# EAGLE design led (EAGLE 9.5.0)
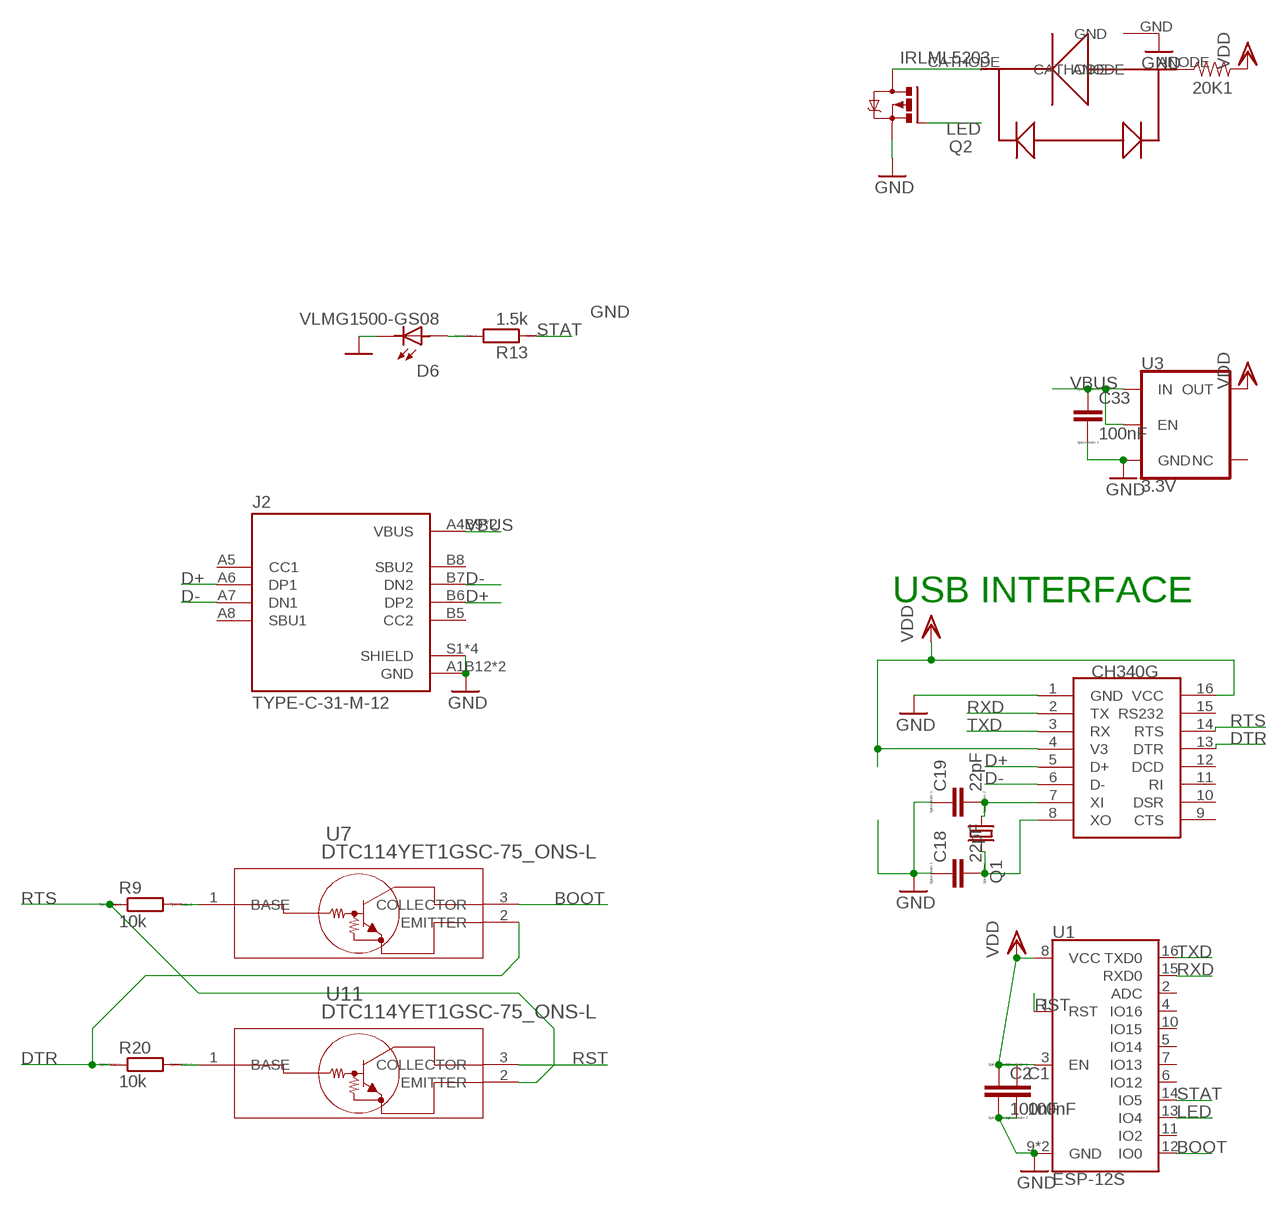
[diagram p0: schematic, sheet 1]

## Parts
20K1  0.05  0.1OHM-1210-1/2W-1%  [1210]
C1  100nF  CC0402  [C0402]
C2  100nF  CC0402  [C0402]
C18  22pF  CC0402  [C0402]
C19  22pF  CC0402  [C0402]
C33  100nF  CC0402  [C0402]
D6  VLMG1500-GS08  [LEDC1005X35N]
J2  TYPE-C-31-M-12  [HRO_TYPE-C-31-M-12]
Q1  KX-7  [3.2X2.5_KX-7]
Q2  IRLML5203  [MICRO3]
R9  10k  RR0402  [R0402]
R13  1.5k  RR0402  [R0402]
R20  10k  RR0402  [R0402]
U1  ESP-12S  [ESP-12S]
U3  3.3V  V_REG_AP2112K-3.3V  [SOT23-5]
U5  H  CH340G  [SOIC16]
U7  DTC114YET1GSC-75_ONS-L  [SC-75_ONS-L]
U11  DTC114YET1GSC-75_ONS-L  [SC-75_ONS-L]
U$1  ELSW(1W)  [ELSW(1W)]

## Nets
BOOT: U1.12(IO0) U7.3(COLLECTOR)
D+: J2.A6(DP1) J2.B6(DP2) U5.5(D+)
D-: J2.A7(DN1) J2.B7(DN2) U5.6(D-)
DTR: R20.1 U5.13(DTR) U7.2(EMITTER)
GND: C1.2 C2.2 C18.1 C19.1 C33.2 D6.2 J2.A1B12(GND) J2.B1A12(GND) J2.S1(SHIELD) J2.S2(SHIELD) J2.S3(SHIELD) J2.S4(SHIELD) Q2.2(S) U1.9(GND) U1.P$1(GND) U3.2(GND) U5.1(GND) U$1.GND
LED: Q2.1(G) U1.13(IO4)
N$1: 20K1.1 U$1.ANODE
N$2: Q2.3(D) U$1.CATHODE
N$5: C18.2 Q1.3 U5.8(XO)
N$9: C19.2 Q1.1 U5.7(XI)
N$27: D6.1 R13.2
N$29: R20.2 U11.1(BASE)
N$30: R9.2 U7.1(BASE)
RST: U1.1(RST) U11.3(COLLECTOR)
RTS: R9.1 U5.14(RTS) U11.2(EMITTER)
RXD: U1.15(RXD0) U5.2(TX)
STAT: R13.1 U1.14(IO5)
TXD: U1.16(TXD0) U5.3(RX)
VBUS: C33.1 J2.A4B9(VBUS) J2.B4A9(VBUS) U3.1(IN) U3.3(EN)
VDD: 20K1.2 C1.1 C2.1 U1.3(EN) U1.8(VCC) U3.5(OUT) U5.4(V3) U5.16(VCC)
Unconnected: J2.A5(CC1) J2.A8(SBU1) J2.B5(CC2) J2.B8(SBU2) U1.2(ADC) U1.4(IO16) U1.5(IO14) U1.6(IO12) U1.7(IO13) U1.10(IO15) U1.11(IO2) U3.4(NC) U5.9(CTS) U5.10(DSR) U5.11(RI) U5.12(DCD) U5.15(RS232)

## Notes on the sheet
- USB INTERFACE

## Library data of the parts
20K1 = SparkFun-Resistors:0.1OHM: 0.1Ω resistor A resistor is a passive two-terminal electrical component that implements electrical resistance as a circuit element. Resistors act to reduce current flow, and, at the same time, act to lower voltage levels within circuits. - Wikipedia; PROD_ID: RES-12374; VALUE: 0.1
C1 C2 C18 C19 C33 = eagle-ltspice:C: CAPACITOR, European symbol; SPICEMODEL: NONE; SPICEPREFIX: C
D6 = VLMG1500-GS08:VLMG1500-GS08: 0402 GREEN 571nm 35MCD 65° Rectangle with Flat Top SMT LED; AVAILABILITY: Unavailable; DESCRIPTION: 0402 GREEN 571nm 35MCD 65° Rectangle with Flat Top SMT LED; MF: Vishay; MP: VLMG1500-GS08; PACKAGE: 0402 Vishay; PRICE: None
J2 = TYPE-C-31-M-12:TYPE-C-31-M-12: USB Connectors 24 Receptacle 1 8.94*7.3mm RoHS Check prices <https://pricing.snapeda.com/parts/TYPE-C-31-M-12/HRO%20Electronics%20Co.%2C%20Ltd./view-part?ref=eda>; AVAILABILITY: Not in stock; DESCRIPTION: USB Connectors 24 Receptacle 1 8.94*7.3mm RoHS; MF: HRO Electronics Co., Ltd.; MP: TYPE-C-31-M-12; PACKAGE: Package; PRICE: None
Q1 = crystal-geyer_V1_0:KX: Quartz Crystals (MHz) SMD: KX - Serie Model Size l/w/h [mm] Frequency Range Frequency Stability Temp. Range [°C] Load Capacitance AECQ 200 availabel Datasheet KX-4 KX-5 KX-6 KX-7 KX-9A KX-9B KX-12A KX-12B KX-13 KX-20 KX-K KX-KS 1.6/1.2/0.3 2.0/1.6/0.45 2.5/2.0/0.55 3.2/2.5/0.8 5.0/3.2/1.0 5.0/3.2/1.1 6.0/3.5/1.1 6.0/3.5/1.0 7.0/5.0 /1.3 11.6/5.5/1.6 12.3/4.5/4.2 12.3/4.5/3.2 24.0 ~ 80.0 MHz 16.0 ~ 80.0 MHz 12.0 ~ 80.0 MHz 8.0 ~ 60.0 MHz 7,68 ~ 300,0 MHz 8,0 ~ 50,0 MHz 8,0 ~ 150,0 MHz 8,0 ~ 50,0 MHz 6,0 ~ 160,0 MHz 3,579 ~ 25,0 MHz 3,579 ~ 70,0 MHz 3,579 ~ 70,0 MHz ±10 … ±50ppm ±10 … ±50ppm ±10 … ±50ppm ±10 … ±50ppm ±10 … ±50ppm ±10 … ±50ppm ±10 … ±50ppm ±10 … ±50ppm ±10 … ±50ppm ±50ppm ±10 … ±50ppm ±10 … ±50ppm (*) -40°C …+85°C (*) -40°C …+125°C (*) -40°C …+125°C (*) -40°C …+125°C (*) -40°C …+105°C (*) -40°C …+105°C (*) -40°C …+125°C (*) -40°C …+105°C (*) -40°C …+105°C (*) -40°C …+105°C (*) -40°C …+85°C (*) -40°C …+85°C 8, 8…16 8, 8…16 10, 8…16 12, 7…20 16, 10…20 16, 10…20 16, 10…20 16, 12…20 16, 12…20 16, 12…20 16, 12…30 16, 12…30 - yes yes yes - - - - - - - - KX-4.pdf <http://www.geyer-electronic.de/uploads/tx_userartikelfrequenz/GEYER-KX-4.pdf> KX-5.pdf <http://www.geyer-electronic.de/uploads/tx_userartikelfrequenz/GEYER-KX-5.pdf> KX-6.pdf <http://www.geyer-electronic.de/uploads/tx_userartikelfrequenz/GEYER-KX-6.pdf> KX-7.pdf <http://www.geyer-electronic.de/uploads/tx_userartikelfrequenz/GEYER-KX-7.pdf> KX-9A.pdf <http://www.geyer-electronic.de/uploads/tx_userartikelfrequenz/GEYER-KX-9A.pdf> KX-9B.pdf <http://www.geyer-electronic.de/uploads/tx_userartikelfrequenz/GEYER-KX-9B.pdf> KX-12A.pdf <http://www.geyer-electronic.de/uploads/tx_userartikelfrequenz/GEYER-KX-12A.pdf> KX-12B.pdf <http://www.geyer-electronic.de/uploads/tx_userartikelfrequenz/GEYER-KX-12B.pdf> KX-13.pdf <http://www.geyer-electronic.de/uploads/tx_userartikelfrequenz/GEYER-KX-13.pdf> KX-20.pdf <http://www.geyer-electronic.de/uploads/tx_userartikelfrequenz/GEYER-KX-20.pdf> KX-K.pdf <http://www.geyer-electronic.de/uploads/tx_userartikelfrequenz/GEYER-KX-K.pdf> KX-KS.pdf <http://www.geyer-electronic.de/uploads/tx_userartikelfrequenz/GEYER-KX-KS.pdf> <http://www.geyer-electronic.de/fileadmin/template/img/logo-geyer-electronic.png> Details see: http://www.geyer-electronic.de/Frequenz-Produkte.9.0.html Created 2016-06-07, Hans Locher 2016 (C) Geyer Quartz Technology KX4,KX5,KX6,KX7,KX9A,KX9B,KX12A,KX12B,KX13,KX20,KXK,KXKS;1612;2016;2520;3225;5032;6035;7050;11655;12345;1,6x1,2;2,0x1,6;2,5x2,0;3,2x2,5;5,0x3,2;6,0x3,5;7,0x5,0;11,6x5,5;12,3x4,5;12,3x4,5;1.6x1.2;2.0x1.6;2.5x2.0;3.2x2.5;5.0x3.2;6.0x3.5;7.0x5.0;11.6x5.5;12.3x4.5;12.3x4.5;
Q2 = transistor-power:IRLML5203: HEXFET P-Channel Power MOSFET
R9 R13 R20 = eagle-ltspice:R: RESISTOR, European symbol; SPICEMODEL: NONE; SPICEPREFIX: R
U1 = ESP-12S:ESP-12S: AI-Thinker ESP-12S ESP-12S WiFi module is developed by AI-Thinker Co.,Ltd, core processor ESP8266 in smaller sizes of the module encapsulates Tensilica L106 integrates industry-leading ultra low power 32-bit MCU micro, with the 16-bit short mode, clock speed support 80 MHz, 160 MHz, supports the RTOS, integrated Wi-Fi MAC/BB/RF/PA/LNA, on-board antennas. Check availability <https://pricing.snapeda.com/parts/ESP-12S/RF%20Solutions/view-part?ref=eda>; AVAILABILITY: In Stock; DESCRIPTION: WiFi 802.11b/g/n Transceiver Module 2.412GHz ~ 2.484GHz PCB Trace Surface Mount; MF: RF Solutions; MP: ESP-12S; PACKAGE: Module RF Solutions; PRICE: None; PURCHASE-URL: https://pricing.snapeda.com/search/part/ESP-12S/?ref=eda
U3 = SparkFun-IC-Power:V_REG_AP2112: AP2112 - 600mA CMOS LDO Regulator w/ Enable The AP2112 is CMOS process low dropout linear regulator with enable function, the regulator delivers a guaranteed 600mA (min.) continuous load current. Features Output Voltage Accuracy: ±1.5% Output Current: 600mA (Min.) Foldback Short Current Protection: 50mA Enable Function to Turn ON/OFF VOUT Low Dropout Voltage (3.3V): 250mV (Typ.) @IOUT=600mA Excellent Load Regulation: 0.2%/A (Typ.) Excellent Line Regulation: 0.02%/V (Typ.) Low Quiescent Current: 55μA (Typ.) Low Standby Current: 0.01μA (Typ.) Low Output Noise: 50μVRMS PSRR: 100Hz -65dB, 1kHz -65dB OTSD Protection Stable with 1.0μF Flexible Cap: Ceramic, Tantalum and Aluminum Electrolytic Operation Temperature Range: -40°C to 85°C ESD: MM 400V, HBM 4000V; PROD_ID: VREG-12457
U5 = ch340g:CH340G
U7 U11 = DTC114YET1G:DTC114YET1G; BUILT_BY: EMA_Justin; COPYRIGHT: Copyright (C) 2018 Accelerated Designs. All rights reserved; DATASHEET: https://www.onsemi.com/pub/Collateral/DTC114Y-D.PDF; MANUFACTURER_PART_NUMBER: DTC114YET1G; SOURCELIBRARY: ON_Semiconductor_2020-01-13; VENDOR: ON Semiconductor
U$1 = ELSW(1W):ELSW(1W)

## Board
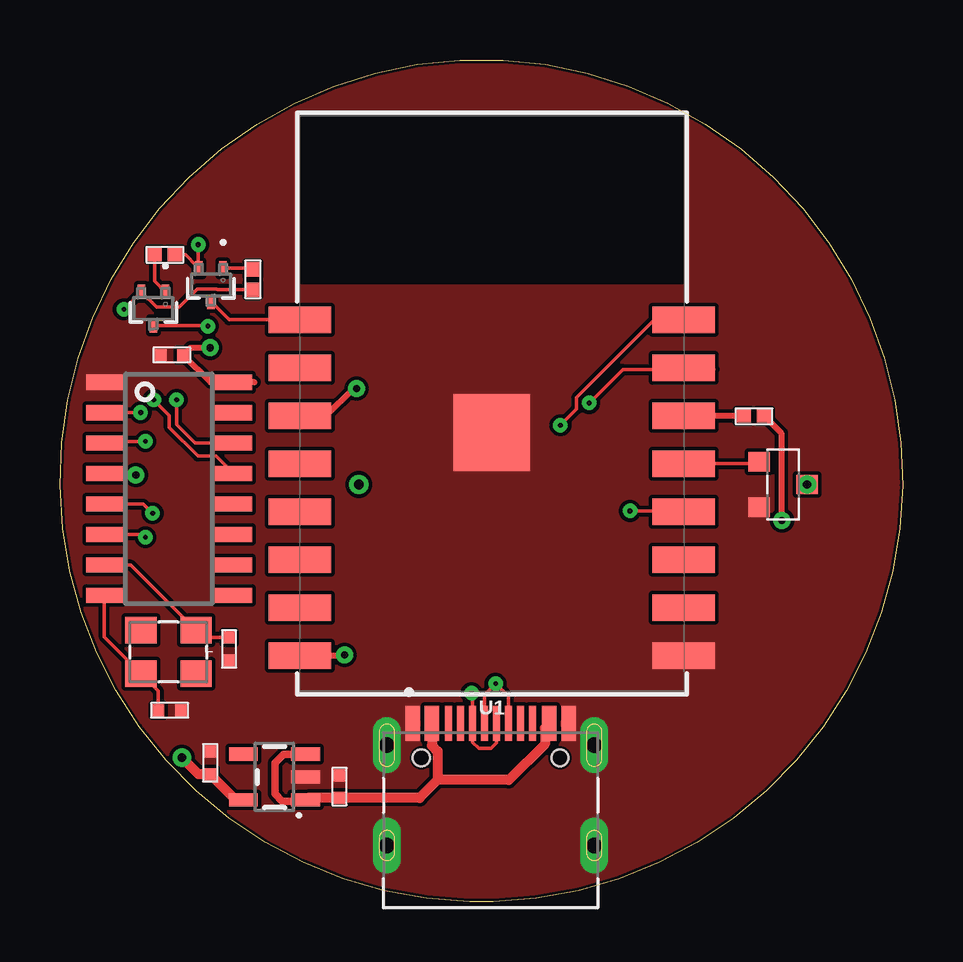
[diagram p1: board, top side]
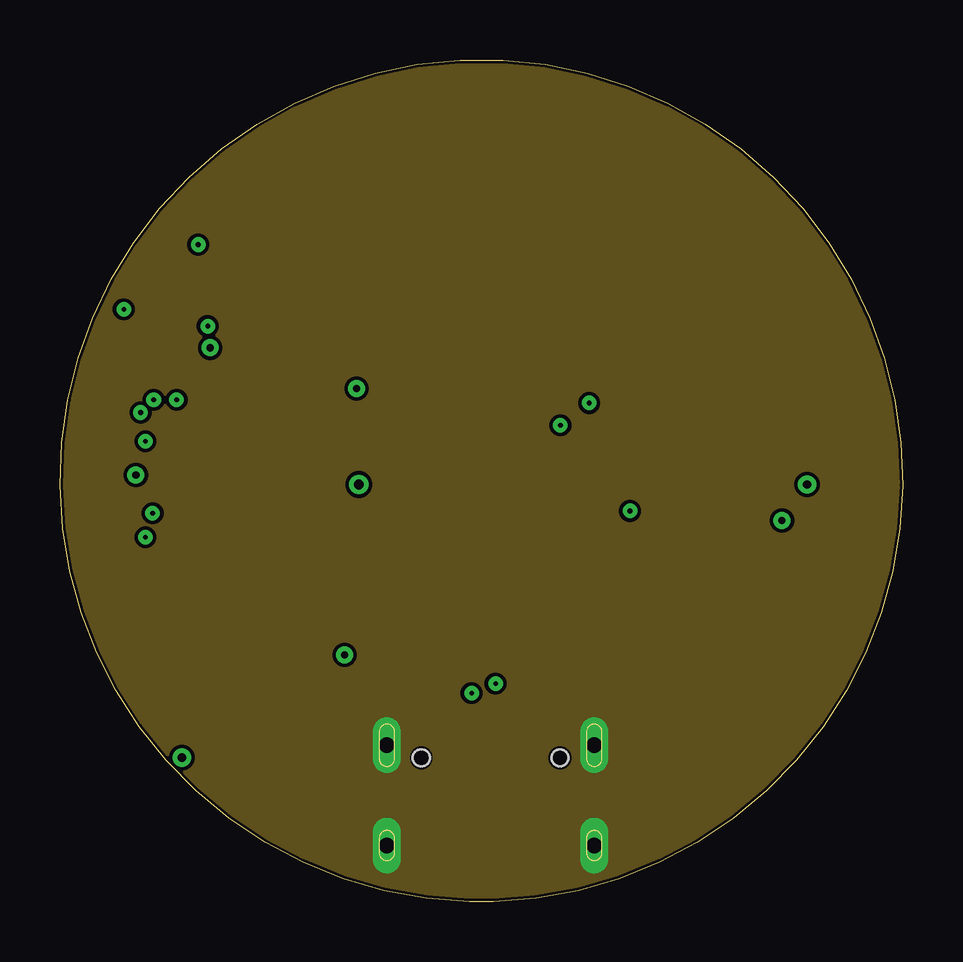
[diagram p2: board, inner layer Route2]
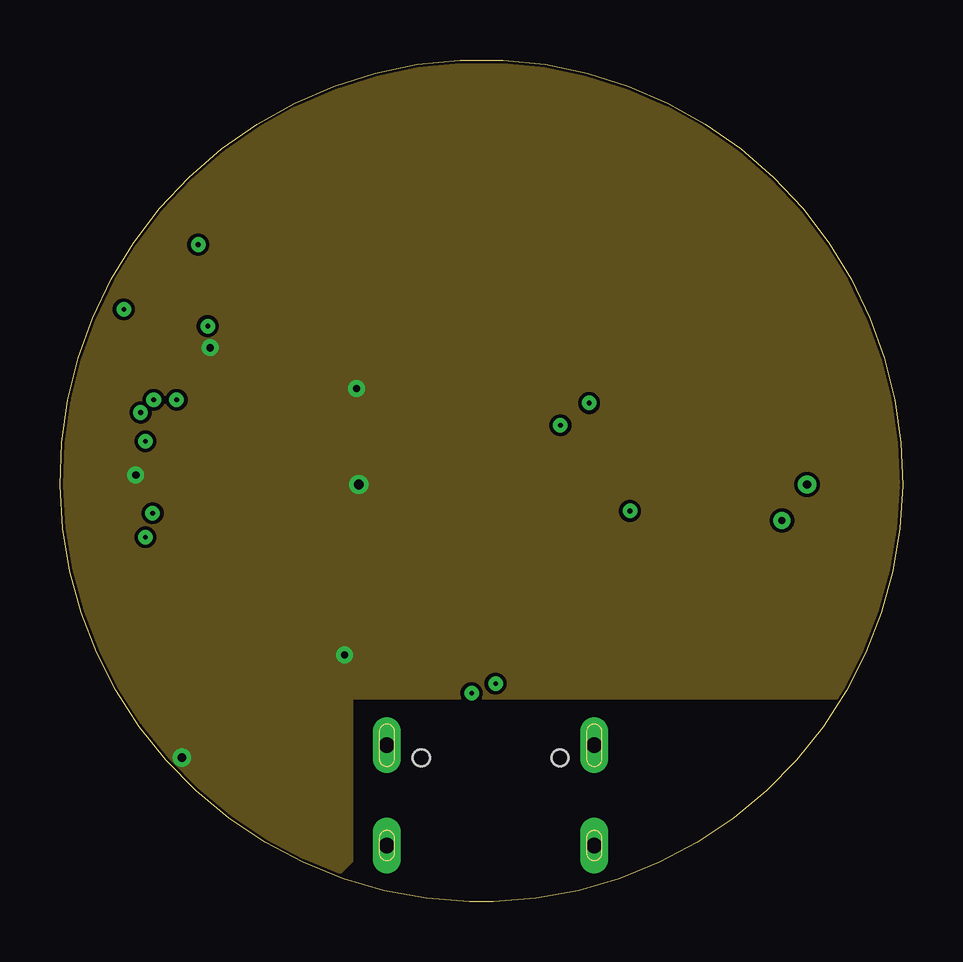
[diagram p3: board, inner layer Route15]
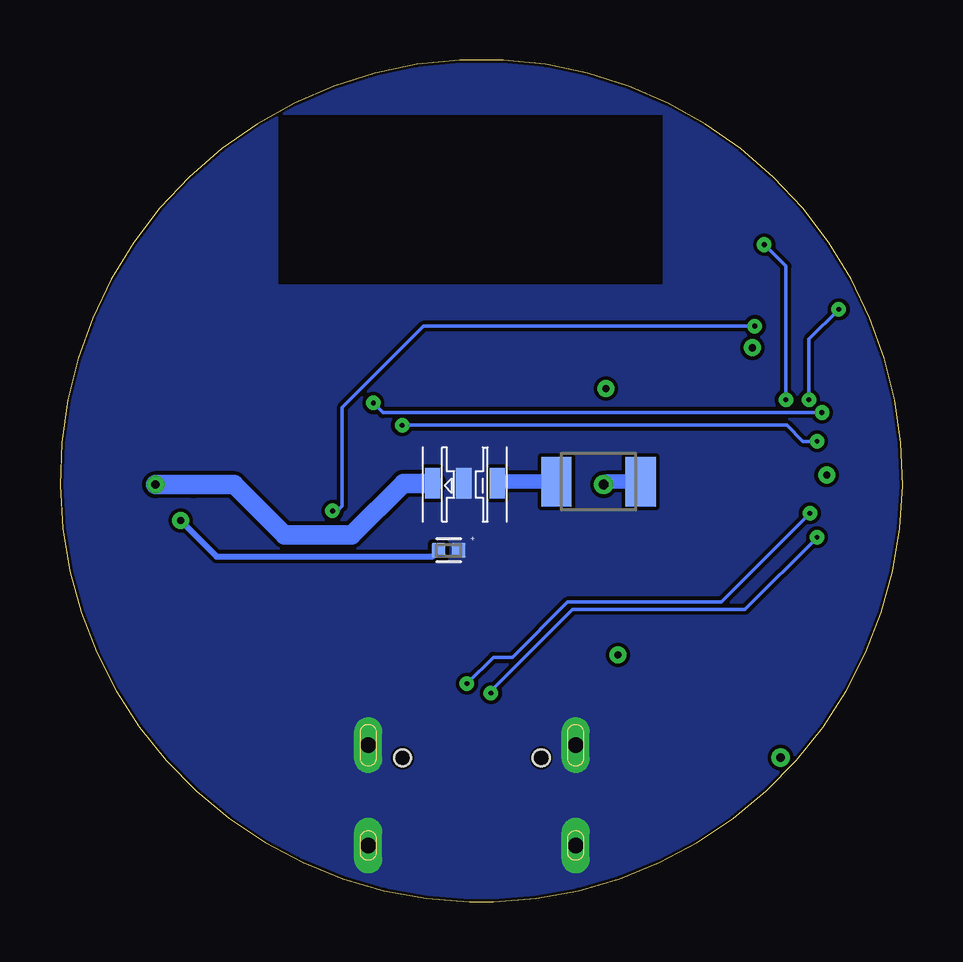
[diagram p4: board, bottom side, seen from below]

Size 35.13 x 35.1 mm. Coordinates in mm from the lower left corner, seen from the top.
Outline: 17.06,0 arc-357 18.06,0 17.06,0
Copper layers (1+2*15+16): Top 0.035mm / dielectric 1.5mm / Route2 0.035mm / dielectric 0.15mm / Route15 0.035mm / dielectric 0.2mm / Bottom 0.035mm
Design rules "default *": minimum track width 5mil, minimum drill 0.2mm, track to track 6mil, track to pad 6mil, pad to pad 6mil, via to via 6mil, smd to smd 6mil, copper to edge 5mil, drill to drill 6mil, minimum pad ring 10mil, minimum via ring 8mil, stop-mask expansion 0mil, vias tented up to drill 40mil, thermal gap 0mil

### Footprints (pad centres in the part's own frame; a part is rotated, then mirrored left to right if it is on the bottom)
1210 = smd 1.27 x 2.06: 1 -1.755,0; 2 1.755,0
C0402 = smd 0.5 x 0.5: 1 -0.475,0; 2 0.475,0
LEDC1005X35N = smd 0.59 x 0.61: 1 -0.415,0; 2 0.415,0
HRO_TYPE-C-31-M-12 = smd 0.6 x 1.45: A1B12 -3.25,5.095; A4B9 -2.45,5.095; B1A12 3.25,5.095; B4A9 2.45,5.095 | smd 0.3 x 1.45: A5 -1.25,5.095; A6 -0.25,5.095; A7 0.25,5.095; A8 1.25,5.095; B5 1.75,5.095; B6 0.75,5.095; B7 -0.75,5.095; B8 -1.75,5.095 | drill 0.65 pad 1.05 long: S1 -4.32,4.18; S2 4.32,4.18; S3 -4.32,0; S4 4.32,0 | hole 0.7: -2.89,3.65; 2.89,3.65
3.2X2.5_KX-7 = smd 1.3 x 1.1: 1 -1.15,-0.9; 2 1.15,-0.9; 3 1.15,0.9; 4 -1.15,0.9
MICRO3 = smd 0.8 x 0.9: 1 -0.95,-1; 2 0.95,-1; 3 0,1
R0402 = smd 0.6 x 0.55: 1 -0.425,0; 2 0.425,0
ESP-12S = smd 2.6 x 1.1: 1 -8,3.5; 2 -8,1.5; 3 -8,-0.5; 4 -8,-2.5; 5 -8,-4.5; 6 -8,-6.5; 7 -8,-8.5; 8 -8,-10.5; 9 8,-10.5; 10 8,-8.5; 11 8,-6.5; 12 8,-4.5; 13 8,-2.5; 14 8,-0.5; 15 8,1.5; 16 8,3.5 | smd 3.2 x 3.2: P$1 0,-1.2
SOT23-5 = smd 0.55 x 1.2: 1 -0.95,-1.3; 2 0,-1.3; 3 0.95,-1.3; 4 0.95,1.3; 5 -0.95,1.3
SOIC16 = smd 0.635 x 1.524: 1 -4.445,-2.695; 2 -3.175,-2.695; 3 -1.905,-2.695; 4 -0.635,-2.695; 5 0.635,-2.695; 6 1.905,-2.695; 7 3.175,-2.695; 8 4.445,-2.695; 9 4.445,2.695; 10 3.175,2.695; 11 1.905,2.695; 12 0.635,2.695; 13 -0.635,2.695; 14 -1.905,2.695; 15 -3.175,2.695; 16 -4.445,2.695
SC-75_ONS-L = smd 0.305 x 0.61: 1 -0.5,-0.699; 2 0.5,-0.699; 3 0,0.699
ELSW(1W) = smd 0.635 x 1.27: ANODE 3,1.6; CATHODE 0.3,1.6; GND 1.6,1.6

### Placement (x,y rotation side)
20K1  12.67,17.52 0 bottom
C1  6.26,5.8 90 top
C2  4.66,22.8 180 top
C18  4.57,7.99 180 top
C19  7.05,10.55 90 top
C33  11.65,4.81 90 top
D6  18.92,14.66 0 bottom
J2  17.95,2.35 0 top
Q1  4.52,10.42 180 top
Q2  30.14,17.4 270 top
R9  4.37,26.98 180 top
R13  28.93,20.25 0 top
R20  8.04,25.95 90 top
U1  18,20.77 0 top
U3  8.94,5.21 90 top
U5  4.54,17.22 270 top
U7  3.89,24.73 180 top
U11  6.29,25.72 180 top
U$1  19.89,15.85 0 bottom

### Tracks (layer width: path | path; a pad name or v marks a point on that pad's centre or on a via)
BOOT  (via drill 0.2)
  Top 0.15: U7.3 6.13,24.03 v6.16,24 | v23.76,16.3 25.97,16.3 U1.12
  Bottom 0.15: v6.16,24 19.96,24 23.36,20.6 23.36,16.5 23.56,16.3 v23.76,16.3
D+  (via drill 0.2)
  Top 0.15: U5.5 3.48,16.59 v3.86,16.2 | J2.B6 18.7,8.56 v18.16,9.1 17.7,8.64 J2.A6
  Bottom 0.15: v3.86,16.2 7.56,12.5 13.96,12.5 16.26,10.2 17.06,10.2 v18.16,9.1
D-  (via drill 0.2)
  Top 0.15: U5.6 3.45,15.31 v3.56,15.2 | v17.16,8.7 17.2,8.66 J2.B7 17.2,6.66 17.46,6.4 17.96,6.4 18.2,6.64 J2.A7
  Bottom 0.15: v3.56,15.2 6.57,12.2 13.77,12.2 17.16,8.8 v17.16,8.7
DTR  (via drill 0.2)
  Top 0.15: R20.1 6.57,25.52 6.54,25.55 5.72,25.55 4.96,24.8 4.03,24.8 U7.2 v2.66,24.7 | U5.13 6.51,18.58 5.76,18.58 4.56,19.77 4.56,20.28 v3.91,20.93
  Bottom 0.15: v3.91,20.93 3.91,23.46 v2.66,24.7
GND
  pour Bottom: -2.34,38.1 35.96,38.1 35.96,0 0.96,0 0.66,-0.3 -2.34,-0.3
  pour Top: -2.64,36.8 35.66,36.8 35.66,-0.2 -2.64,-0.2
  pour Route2: -2.54,37.1 35.76,37.1 35.76,-0.4 -2.54,-0.4
LED
  Top 0.15: U1.13 29.06,18.27 Q2.1
N$1
  Bottom 0.61: 20K1.1 16.82,17.52 U$1.ANODE
N$2  (via drill 0.35)
  Bottom 0.813: U$1.CATHODE 20.81,17.45 22.96,15.3 25.76,15.3 27.86,17.4 29.56,17.4 Q2.3
  other vias: 31.14,17.4
N$5
  Top 0.15: C18.2 4.1,8.79 Q1.3 1.85,11.04 U5.8
N$9
  Top 0.15: C19.2 5.97,11.03 Q1.1 2.95,14.04 U5.7
N$27  (via drill 0.3)
  Top 0.254: R13.2 30.06,19.55 30.06,15.94 v30.1,15.9
  Bottom 0.254: v30.1,15.9 28.6,14.4 19.6,14.4 D6.1
N$29
  Top 0.15: U11.1 8,26.42 R20.2
N$30
  Top 0.15: U7.1 3.95,25.87 R9.2
RST
  Top 0.15: U1.1 7.05,24.27 U11.3
RTS  (via drill 0.2)
  Top 0.15: U11.2 5.69,26.52 | 5.69,26.52 5.23,26.98 R9.1 | U5.14 5.64,19.12 4.86,19.9 v4.86,20.93 | v5.76,27.4 5.76,26.6 5.69,26.52
  Bottom 0.15: v4.86,20.93 4.86,26.5 v5.76,27.4
RXD  (via drill 0.2)
  Top 0.15: U5.2 v3.36,20.39 v3.36,20.4 | v22.06,20.8 23.46,22.2 25.66,22.2 25.93,22.2 | 25.93,22.2 27.26,22.2 | U1.15 25.93,22.2
  Bottom 0.15: v3.36,20.4 21.66,20.4 v22.06,20.8
STAT
  Top 0.15: 26.36,20.27 U1.14
  Top 0.254: R13.1 26.38,20.25 26.36,20.27
TXD  (via drill 0.2)
  Top 0.15: v20.86,19.87 21.53,20.54 21.53,21.02 24.78,24.27 U1.16 | v3.56,19.2 1.92,19.2 U5.3
  Bottom 0.15: v20.86,19.87 4.83,19.87 4.16,19.2 v3.56,19.2
VBUS
  Top 0.305: U3.3 9.32,6.16 8.96,5.8 8.96,4.5 9.26,4.2 10.18,4.2 10.32,4.33
  Top 0.406: J2.A4B9 15.5,6.52 15.74,6.28 15.74,5.08 | 15.74,5.08 15,4.33 C33.1 10.32,4.33 U3.1 | J2.B4A9 20.21,7.25 20.21,6.57 18.72,5.08 15.74,5.08
VDD  (via drill 0.3, 0.35, 0.4)
  Top 0.254: U1.8 11.83,10.27 v11.86,10.3 | U5.4 3.11,17.86 v3.16,17.8 | 9.49,20.27 U1.3 11.1,20.27 12.23,21.4 v12.36,21.4 | 8.1,21.66 U5.16 6.27,21.66 C2.1 5.44,23.1 v6.26,23.1
  Top 0.406: U3.5 7.33,4.26 C1.1 5.78,5.33 v5.08,6.02
  Bottom 0.61: 20K1.2 12.34,17.52 v12.46,17.4
  pour Route15: -1.94,36.7 36.36,36.7 36.36,8.5 -1.94,8.5
  pour Route15: 1.06,10.6 10.46,10.6 12.16,8.9 12.16,1.7 11.06,0.6 4.86,0.6 2.26,3.2 1.06,4.4